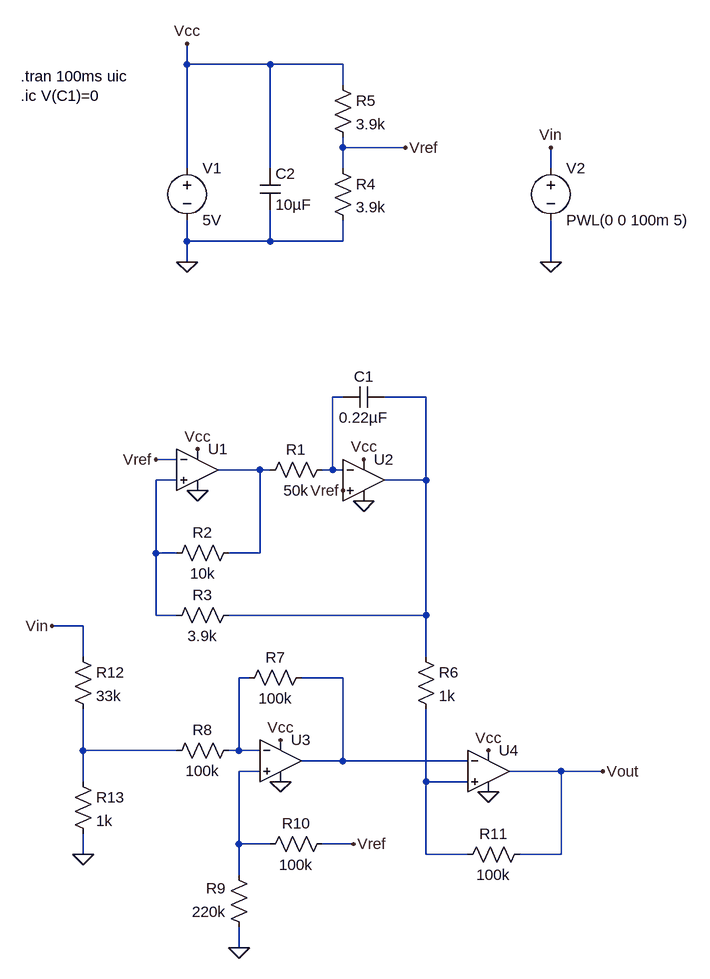
[diagram p0: schematic voltage-controlled-servo-controller.asc]
voltage-controlled-servo-controller.asc, the LTspice schematic file:
Version 4
SHEET 1 888 836
WIRE 96 -544 96 -576
WIRE 224 -544 96 -544
WIRE 336 -544 224 -544
WIRE 336 -512 336 -544
WIRE 336 -416 336 -432
WIRE 432 -416 336 -416
WIRE 96 -384 96 -544
WIRE 224 -384 224 -544
WIRE 336 -384 336 -416
WIRE 656 -384 656 -416
WIRE 96 -272 96 -304
WIRE 224 -272 224 -320
WIRE 224 -272 96 -272
WIRE 336 -272 336 -304
WIRE 336 -272 224 -272
WIRE 96 -240 96 -272
WIRE 656 -240 656 -304
WIRE 336 -32 320 -32
WIRE 464 -32 400 -32
WIRE 80 64 48 64
WIRE 208 80 144 80
WIRE 224 80 208 80
WIRE 320 80 320 -32
WIRE 320 80 304 80
WIRE 336 80 320 80
WIRE 80 96 48 96
WIRE 464 96 464 -32
WIRE 464 96 400 96
WIRE 48 208 48 96
WIRE 80 208 48 208
WIRE 208 208 208 80
WIRE 208 208 160 208
WIRE 48 304 48 208
WIRE 80 304 48 304
WIRE 464 304 464 96
WIRE 464 304 160 304
WIRE -64 320 -112 320
WIRE -64 368 -64 320
WIRE 464 368 464 304
WIRE 192 400 176 400
WIRE 336 400 272 400
WIRE -64 512 -64 448
WIRE 80 512 -64 512
WIRE 176 512 176 400
WIRE 176 512 160 512
WIRE 208 512 176 512
WIRE 336 528 336 400
WIRE 336 528 272 528
WIRE 528 528 336 528
WIRE 208 544 176 544
WIRE 672 544 592 544
WIRE 736 544 672 544
WIRE -64 560 -64 512
WIRE 464 560 464 448
WIRE 528 560 464 560
WIRE 176 656 176 544
WIRE 224 656 176 656
WIRE 352 656 304 656
WIRE -64 672 -64 640
WIRE 464 672 464 560
WIRE 528 672 464 672
WIRE 672 672 672 544
WIRE 672 672 608 672
WIRE 176 704 176 656
WIRE 176 816 176 784
FLAG 96 -576 Vcc
FLAG 112 48 Vcc
FLAG 368 64 Vcc
FLAG 96 -240 0
FLAG 112 112 0
FLAG 368 128 0
FLAG 432 -416 Vref
FLAG 48 64 Vref
FLAG 336 112 Vref
FLAG 240 560 0
FLAG 560 576 0
FLAG -64 672 0
FLAG -112 320 Vin
FLAG 352 656 Vref
FLAG 176 816 0
FLAG 736 544 Vout
FLAG 656 -240 0
FLAG 656 -416 Vin
FLAG 240 496 Vcc
FLAG 560 512 Vcc
SYMBOL res 320 64 R90
WINDOW 0 0 56 VBottom 2
WINDOW 3 32 56 VTop 2
SYMATTR InstName R1
SYMATTR Value 50k
SYMBOL res 176 192 R90
WINDOW 0 0 56 VBottom 2
WINDOW 3 32 56 VTop 2
SYMATTR InstName R2
SYMATTR Value 10k
SYMBOL res 176 288 R90
WINDOW 0 0 56 VBottom 2
WINDOW 3 32 56 VTop 2
SYMATTR InstName R3
SYMATTR Value 3.9k
SYMBOL cap 400 -48 R90
WINDOW 0 0 32 VBottom 2
WINDOW 3 32 32 VTop 2
SYMATTR InstName C1
SYMATTR Value 0.22µF
SYMBOL voltage 96 -400 R0
WINDOW 123 0 0 Left 0
WINDOW 39 0 0 Left 0
SYMATTR InstName V1
SYMATTR Value 5V
SYMBOL cap 208 -384 R0
SYMATTR InstName C2
SYMATTR Value 10µF
SYMBOL res 320 -400 R0
SYMATTR InstName R4
SYMATTR Value 3.9k
SYMBOL res 320 -528 R0
SYMATTR InstName R5
SYMATTR Value 3.9k
SYMBOL res 448 352 R0
SYMATTR InstName R6
SYMATTR Value 1k
SYMBOL res 288 384 R90
WINDOW 0 0 56 VBottom 2
WINDOW 3 32 56 VTop 2
SYMATTR InstName R7
SYMATTR Value 100k
SYMBOL res 176 496 R90
WINDOW 0 0 56 VBottom 2
WINDOW 3 32 56 VTop 2
SYMATTR InstName R8
SYMATTR Value 100k
SYMBOL res 192 800 R180
WINDOW 0 36 76 Left 2
WINDOW 3 36 40 Left 2
SYMATTR InstName R9
SYMATTR Value 220k
SYMBOL res 208 672 R270
WINDOW 0 32 56 VTop 2
WINDOW 3 0 56 VBottom 2
SYMATTR InstName R10
SYMATTR Value 100k
SYMBOL res 624 656 R90
WINDOW 0 0 56 VBottom 2
WINDOW 3 32 56 VTop 2
SYMATTR InstName R11
SYMATTR Value 100k
SYMBOL res -80 352 R0
SYMATTR InstName R12
SYMATTR Value 33k
SYMBOL res -80 544 R0
SYMATTR InstName R13
SYMATTR Value 1k
SYMBOL voltage 656 -400 R0
WINDOW 123 0 0 Left 0
WINDOW 39 0 0 Left 0
SYMATTR InstName V2
SYMATTR Value PWL(0 0 100m 5)
SYMBOL OpAmps\\UniversalOpamp2 112 80 R0
SYMATTR InstName U1
SYMBOL OpAmps\\UniversalOpamp2 368 96 R0
SYMATTR InstName U2
SYMBOL OpAmps\\UniversalOpamp2 240 528 R0
SYMATTR InstName U3
SYMBOL OpAmps\\UniversalOpamp2 560 544 R0
SYMATTR InstName U4
TEXT -160 -526 Left 2 !.tran 100ms uic
TEXT -160 -496 Left 2 !.ic V(C1)=0

The netlist it stands for:
* voltage-controlled-servo-controller.asc
R1 N001 N003 50k
R2 N003 N004 10k
R3 N002 N004 3.9k
C1 N002 N001 0.22µF
V1 Vcc 0 5V
C2 Vcc 0 10µF
R4 Vref 0 3.9k
R5 Vcc Vref 3.9k
R6 N002 N009 1k
R7 N006 N005 100k
R8 N005 N007 100k
R9 0 N008 220k
R10 N008 Vref 100k
R11 Vout N009 100k
R12 Vin N007 33k
R13 N007 0 1k
V2 Vin 0 PWL(0 0 100m 5)
XU1 N004 Vref Vcc 0 N003 level.2 Avol=1Meg GBW=10Meg Slew=10Meg ilimit=25m rail=0 Vos=0 phimargin=45 en=0 enk=0 in=0 ink=0 Rin=500Meg  ; pins IN+ IN- V+ V- OUT
XU2 Vref N001 Vcc 0 N002 level.2 Avol=1Meg GBW=10Meg Slew=10Meg ilimit=25m rail=0 Vos=0 phimargin=45 en=0 enk=0 in=0 ink=0 Rin=500Meg  ; pins IN+ IN- V+ V- OUT
XU3 N008 N005 Vcc 0 N006 level.2 Avol=1Meg GBW=10Meg Slew=10Meg ilimit=25m rail=0 Vos=0 phimargin=45 en=0 enk=0 in=0 ink=0 Rin=500Meg  ; pins IN+ IN- V+ V- OUT
XU4 N009 N006 Vcc 0 Vout level.2 Avol=1Meg GBW=10Meg Slew=10Meg ilimit=25m rail=0 Vos=0 phimargin=45 en=0 enk=0 in=0 ink=0 Rin=500Meg  ; pins IN+ IN- V+ V- OUT
.tran 100ms uic
.ic V(C1)=0
.lib UniversalOpamps2.sub
.backanno
.end